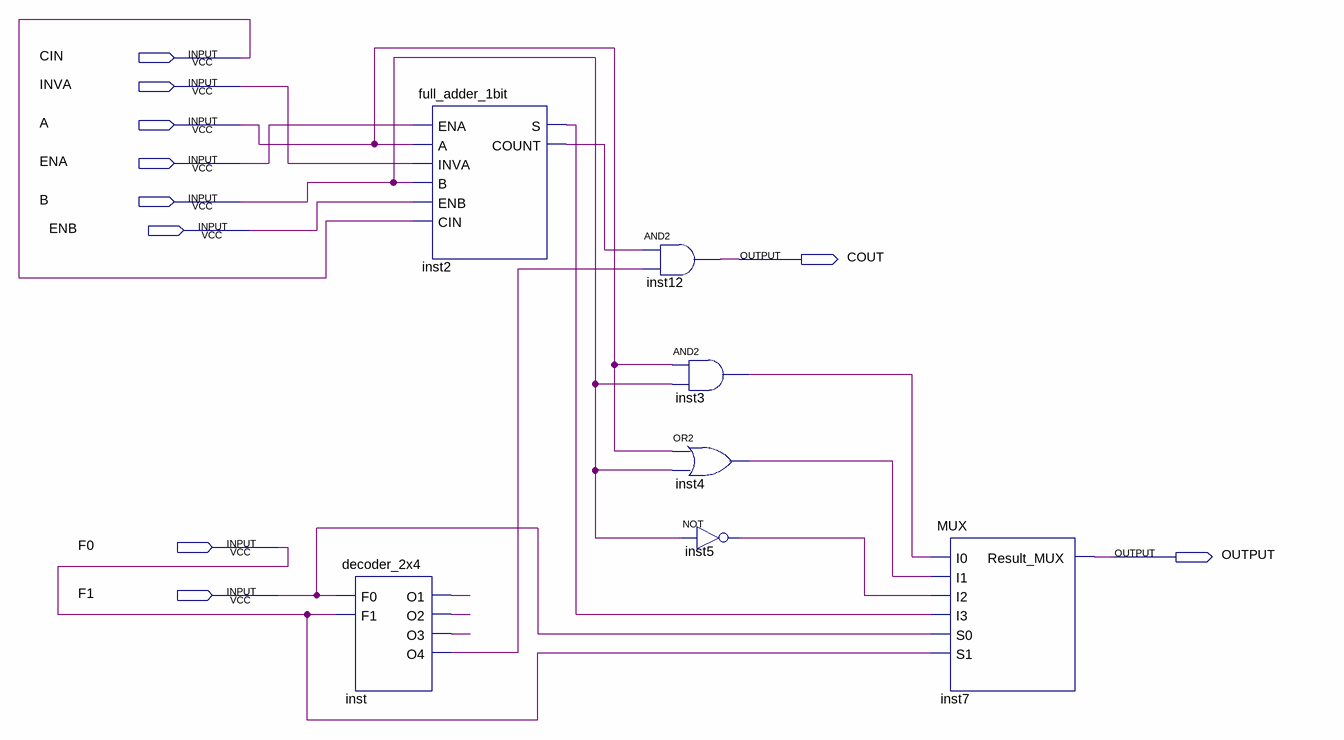
[diagram p0: schematic sheet]
// Quartus schematic ULA_1bit.bdf as structural Verilog: 7 symbols, 10 pins
module ULA_1bit (
  input  CIN,
  input  INVA,
  input  A,
  input  ENA,
  input  B,
  input  ENB,
  input  F0,
  input  F1,
  output COUT,
  output OUTPUT
);

  wire inst2_count, inst2_s, inst3_out, inst4_out, inst5_out, inst_o1, inst_o2, inst_o3, inst_o4;

  decoder_2x4 inst (.F0(F1), .F1(F0), .O1(inst_o1), .O2(inst_o2), .O3(inst_o3), .O4(inst_o4));
  full_adder_1bit inst2 (.ENA(ENA), .A(A), .INVA(INVA), .B(B), .ENB(ENB), .CIN(CIN), .S(inst2_s), .COUNT(inst2_count));
  and inst12 (COUT, inst2_count, inst_o4);
  and inst3 (inst3_out, A, B);
  or inst4 (inst4_out, A, B);
  not inst5 (inst5_out, B);
  MUX inst7 (.I0(inst3_out), .I1(inst4_out), .I2(inst5_out), .I3(inst2_s), .S0(F1), .S1(F0), .Result_MUX(OUTPUT));
endmodule
